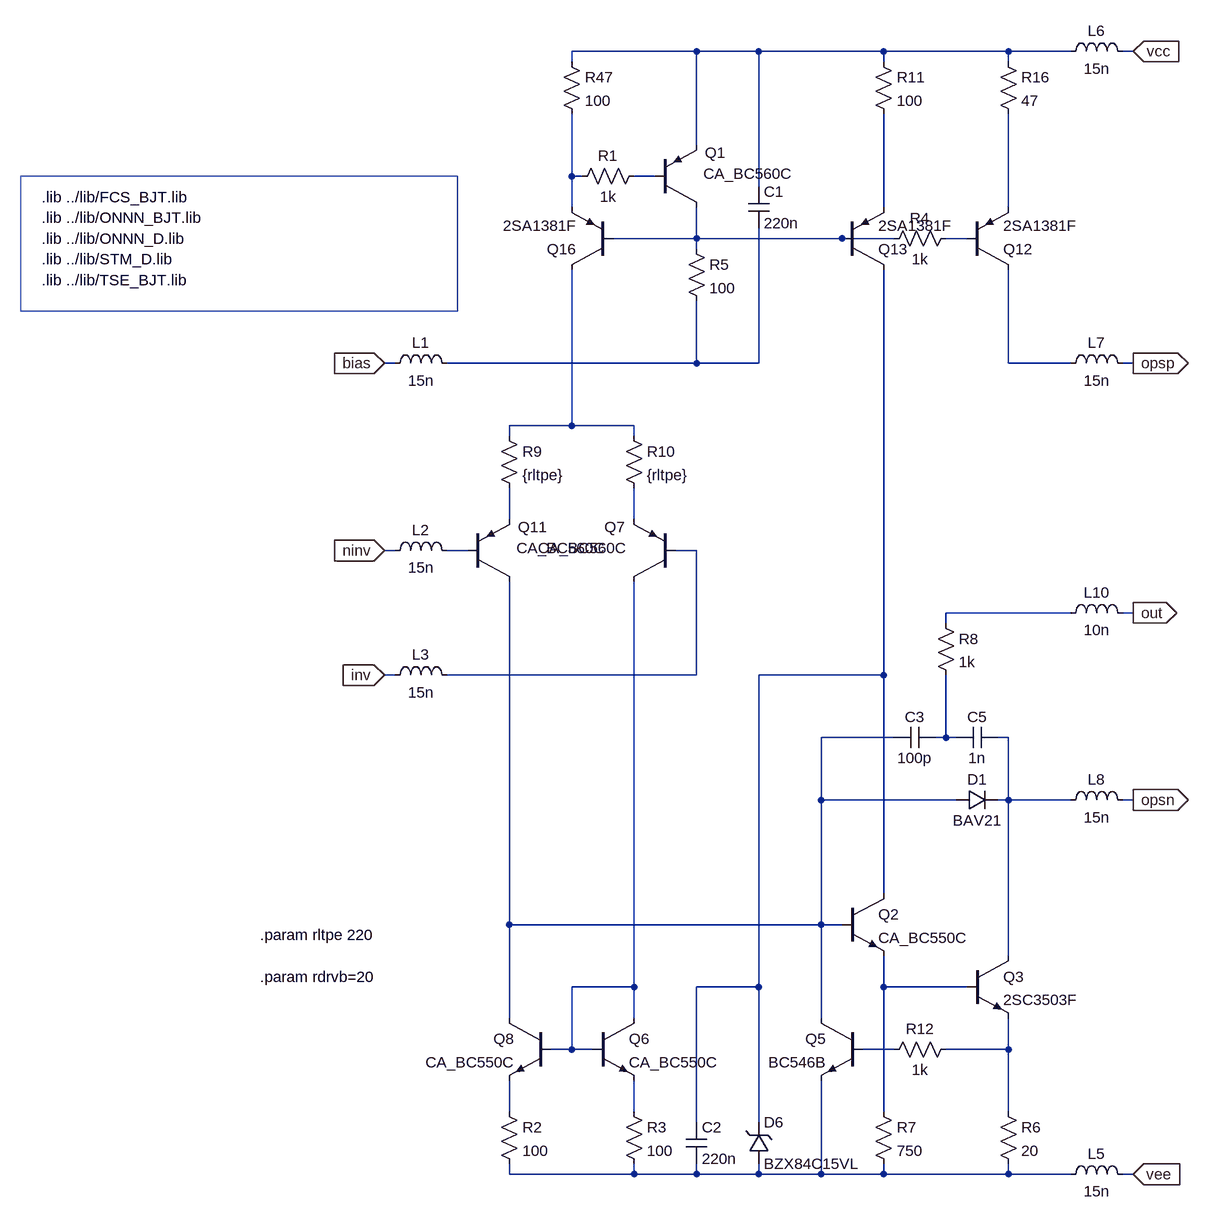
[diagram p0: schematic pab3bbb-mini-module.asc]
pab3bbb-mini-module.asc, the LTspice schematic file:
Version 4
SHEET 1 6124 2336
WIRE 288 -1088 96 -1088
WIRE 384 -1088 288 -1088
WIRE 576 -1088 384 -1088
WIRE 768 -1088 576 -1088
WIRE 864 -1088 768 -1088
WIRE 960 -1088 944 -1088
WIRE 96 -1072 96 -1088
WIRE 576 -1072 576 -1088
WIRE 768 -1072 768 -1088
WIRE 288 -944 288 -1088
WIRE 96 -896 96 -992
WIRE 112 -896 96 -896
WIRE 224 -896 192 -896
WIRE 384 -880 384 -1088
WIRE 96 -848 96 -896
WIRE 576 -848 576 -992
WIRE 768 -848 768 -992
WIRE 288 -800 288 -848
WIRE 288 -800 160 -800
WIRE 512 -800 288 -800
WIRE 592 -800 512 -800
WIRE 704 -800 672 -800
WIRE 288 -784 288 -800
WIRE -176 -608 -192 -608
WIRE 288 -608 288 -704
WIRE 288 -608 -96 -608
WIRE 384 -608 384 -816
WIRE 384 -608 288 -608
WIRE 768 -608 768 -752
WIRE 864 -608 768 -608
WIRE 960 -608 944 -608
WIRE 96 -512 96 -752
WIRE 96 -512 0 -512
WIRE 192 -512 96 -512
WIRE 0 -496 0 -512
WIRE 192 -496 192 -512
WIRE 0 -368 0 -416
WIRE 192 -368 192 -416
WIRE -176 -320 -192 -320
WIRE -64 -320 -96 -320
WIRE 288 -320 256 -320
WIRE 864 -224 672 -224
WIRE 960 -224 944 -224
WIRE 672 -208 672 -224
WIRE -176 -128 -192 -128
WIRE 288 -128 288 -320
WIRE 288 -128 -96 -128
WIRE 576 -128 576 -752
WIRE 576 -128 384 -128
WIRE 592 -32 480 -32
WIRE 672 -32 672 -128
WIRE 672 -32 656 -32
WIRE 688 -32 672 -32
WIRE 768 -32 752 -32
WIRE 480 64 480 -32
WIRE 688 64 480 64
WIRE 768 64 768 -32
WIRE 768 64 752 64
WIRE 864 64 768 64
WIRE 960 64 944 64
WIRE 576 208 576 -128
WIRE 0 256 0 -272
WIRE 480 256 480 64
WIRE 480 256 0 256
WIRE 512 256 480 256
WIRE 768 304 768 64
WIRE 192 352 192 -272
WIRE 192 352 96 352
WIRE 384 352 384 -128
WIRE 384 352 288 352
WIRE 576 352 576 304
WIRE 704 352 576 352
WIRE 0 400 0 256
WIRE 192 400 192 352
WIRE 480 400 480 256
WIRE 96 448 96 352
WIRE 96 448 64 448
WIRE 128 448 96 448
WIRE 592 448 544 448
WIRE 768 448 768 400
WIRE 768 448 672 448
WIRE 0 544 0 496
WIRE 192 544 192 496
WIRE 576 544 576 352
WIRE 768 544 768 448
WIRE 288 560 288 352
WIRE 384 560 384 352
WIRE 0 640 0 624
WIRE 192 640 192 624
WIRE 192 640 0 640
WIRE 288 640 288 624
WIRE 288 640 192 640
WIRE 384 640 384 624
WIRE 384 640 288 640
WIRE 480 640 480 496
WIRE 480 640 384 640
WIRE 576 640 576 624
WIRE 576 640 480 640
WIRE 768 640 768 624
WIRE 768 640 576 640
WIRE 864 640 768 640
WIRE 960 640 944 640
FLAG 960 -224 out
IOPIN 960 -224 Out
FLAG 960 -1088 vcc
IOPIN 960 -1088 In
FLAG 960 640 vee
IOPIN 960 640 In
FLAG -192 -320 ninv
IOPIN -192 -320 In
FLAG -192 -128 inv
IOPIN -192 -128 In
FLAG 960 -608 opsp
IOPIN 960 -608 Out
FLAG 960 64 opsn
IOPIN 960 64 Out
FLAG -192 -608 bias
IOPIN -192 -608 In
SYMBOL pnp -64 -272 M180
WINDOW 0 77 84 Left 2
WINDOW 3 75 52 Left 2
SYMATTR InstName Q11
SYMATTR Value CA_BC560C
SYMBOL res -16 528 R0
SYMATTR InstName R2
SYMATTR Value 100
SYMBOL res 176 528 R0
SYMATTR InstName R3
SYMATTR Value 100
SYMBOL res -16 -512 R0
SYMATTR InstName R9
SYMATTR Value {rltpe}
SYMBOL res 176 -512 R0
SYMATTR InstName R10
SYMATTR Value {rltpe}
SYMBOL res 752 -1088 R0
SYMATTR InstName R16
SYMATTR Value 47
SYMBOL res 80 -1088 R0
SYMATTR InstName R47
SYMATTR Value 100
SYMBOL npn 704 304 R0
SYMATTR InstName Q3
SYMATTR Value 2SC3503F
SYMBOL res 752 528 R0
SYMATTR InstName R6
SYMATTR Value 20
SYMBOL pnp 256 -272 R180
WINDOW 0 77 84 Left 2
WINDOW 3 75 52 Left 2
SYMATTR InstName Q7
SYMATTR Value CA_BC560C
SYMBOL cap 656 -48 R90
WINDOW 0 0 32 VBottom 2
WINDOW 3 32 32 VTop 2
SYMATTR InstName C3
SYMATTR Value 100p
SYMATTR SpiceLine V=100 Irms=20.8m Rser=5.448 Lser=3n Rpar=6.4meg Cpar=1p
SYMBOL npn 128 400 R0
SYMATTR InstName Q6
SYMATTR Value CA_BC550C
SYMBOL npn 64 400 M0
SYMATTR InstName Q8
SYMATTR Value CA_BC550C
SYMBOL npn 512 208 R0
SYMATTR InstName Q2
SYMATTR Value CA_BC550C
SYMBOL res 560 528 R0
SYMATTR InstName R7
SYMATTR Value 750
SYMBOL cap 752 -48 R90
WINDOW 0 0 32 VBottom 2
WINDOW 3 32 32 VTop 2
SYMATTR InstName C5
SYMATTR Value 1n
SYMATTR SpiceLine V=100 Irms=75.3m Rser=2.89088 Lser=3n Rpar=4.4meg Cpar=1p
SYMBOL res 656 -224 R0
SYMATTR InstName R8
SYMATTR Value 1k
SYMBOL diode 688 80 R270
WINDOW 0 32 32 VTop 2
WINDOW 3 0 32 VBottom 2
SYMATTR InstName D1
SYMATTR Value BAV21
SYMBOL ind 848 656 R270
WINDOW 0 32 56 VTop 2
WINDOW 3 5 56 VBottom 2
SYMATTR InstName L5
SYMATTR Value 15n
SYMATTR SpiceLine Rser=20m
SYMBOL ind 848 -1072 R270
WINDOW 0 32 56 VTop 2
WINDOW 3 5 56 VBottom 2
SYMATTR InstName L6
SYMATTR Value 15n
SYMATTR SpiceLine Rser=20m
SYMBOL ind 848 -592 R270
WINDOW 0 32 56 VTop 2
WINDOW 3 5 56 VBottom 2
SYMATTR InstName L7
SYMATTR Value 15n
SYMATTR SpiceLine Rser=20m
SYMBOL ind 848 80 R270
WINDOW 0 32 56 VTop 2
WINDOW 3 5 56 VBottom 2
SYMATTR InstName L8
SYMATTR Value 15n
SYMATTR SpiceLine Rser=20m
SYMBOL ind -192 -304 R270
WINDOW 0 32 56 VTop 2
WINDOW 3 5 56 VBottom 2
SYMATTR InstName L2
SYMATTR Value 15n
SYMATTR SpiceLine Rser=20m
SYMBOL ind -192 -112 R270
WINDOW 0 32 56 VTop 2
WINDOW 3 5 56 VBottom 2
SYMATTR InstName L3
SYMATTR Value 15n
SYMATTR SpiceLine Rser=20m
SYMBOL ind 848 -208 R270
WINDOW 0 32 56 VTop 2
WINDOW 3 5 56 VBottom 2
SYMATTR InstName L10
SYMATTR Value 10n
SYMATTR SpiceLine Rser=10m
SYMBOL npn 544 400 M0
SYMATTR InstName Q5
SYMATTR Value BC546B
SYMBOL res 688 432 R90
WINDOW 0 0 56 VBottom 2
WINDOW 3 32 56 VTop 2
SYMATTR InstName R12
SYMATTR Value 1k
SYMBOL pnp 704 -752 M180
SYMATTR InstName Q12
SYMATTR Value 2SA1381F
SYMBOL pnp 160 -752 R180
SYMATTR InstName Q16
SYMATTR Value 2SA1381F
SYMBOL pnp 512 -752 M180
SYMATTR InstName Q13
SYMATTR Value 2SA1381F
SYMBOL res 560 -1088 R0
SYMATTR InstName R11
SYMATTR Value 100
SYMBOL zener 368 624 M180
WINDOW 0 24 64 Left 2
WINDOW 3 24 0 Left 2
SYMATTR InstName D6
SYMATTR Value BZX84C15VL
SYMATTR Description Diode
SYMATTR Type diode
SYMBOL cap 272 624 M180
WINDOW 0 24 56 Left 2
WINDOW 3 24 8 Left 2
SYMATTR InstName C2
SYMATTR Value 220n
SYMATTR SpiceLine V=25 Irms=1.76 Rser=0.057522 Lser=3n Rpar=4.4meg Cpar=1p
SYMBOL cap 368 -816 M180
WINDOW 0 24 56 Left 2
WINDOW 3 24 8 Left 2
SYMATTR InstName C1
SYMATTR Value 220n
SYMATTR SpiceLine V=25 Irms=1.76 Rser=0.057522 Lser=3n Rpar=4.4meg Cpar=1p
SYMBOL res 208 -912 R90
WINDOW 0 0 56 VBottom 2
WINDOW 3 32 56 VTop 2
SYMATTR InstName R1
SYMATTR Value 1k
SYMBOL pnp 224 -848 M180
WINDOW 0 77 84 Left 2
WINDOW 3 75 52 Left 2
SYMATTR InstName Q1
SYMATTR Value CA_BC560C
SYMBOL res 688 -816 R90
WINDOW 0 0 56 VBottom 2
WINDOW 3 32 56 VTop 2
SYMATTR InstName R4
SYMATTR Value 1k
SYMBOL ind -192 -592 R270
WINDOW 0 32 56 VTop 2
WINDOW 3 5 56 VBottom 2
SYMATTR InstName L1
SYMATTR Value 15n
SYMATTR SpiceLine Rser=20m
SYMBOL res 272 -800 R0
SYMATTR InstName R5
SYMATTR Value 100
TEXT -384 272 Left 2 !.param rltpe 220
TEXT -720 -832 Left 2 !.lib ../lib/ONNN_BJT.lib
TEXT -720 -768 Left 2 !.lib ../lib/STM_D.lib
TEXT -720 -864 Left 2 !.lib ../lib/FCS_BJT.lib
TEXT -720 -800 Left 2 !.lib ../lib/ONNN_D.lib
TEXT -720 -736 Left 2 !.lib ../lib/TSE_BJT.lib
TEXT -384 336 Left 2 !.param rdrvb=20
RECTANGLE Normal -80 -688 -752 -896

The netlist it stands for:
* pab3bbb-mini-module.asc
Q11 N017 N013 N011 0 CA_BC560C
R2 N024 N026 100
R3 N025 N026 100
R9 N010 N011 {rltpe}
R10 N010 N012 {rltpe}
R16 N001 N005 47
R47 N001 N002 100
Q3 N019 N021 N023 0 2SC3503F
R6 N023 N026 20
Q7 N020 N014 N012 0 CA_BC560C
C3 N018 N017 100p V=100 Irms=20.8m Rser=5.448 Lser=3n Rpar=6.4meg Cpar=1p
Q6 N020 N020 N025 0 CA_BC550C
Q8 N017 N020 N024 0 CA_BC550C
Q2 N016 N017 N021 0 CA_BC550C
R7 N021 N026 750
C5 N019 N018 1n V=100 Irms=75.3m Rser=2.89088 Lser=3n Rpar=4.4meg Cpar=1p
R8 N015 N018 1k
D1 N017 N019 BAV21
L5 N026 vee 15n Rser=20m
L6 N001 vcc 15n Rser=20m
L7 N009 opsp 15n Rser=20m
L8 N019 opsn 15n Rser=20m
L2 ninv N013 15n Rser=20m
L3 inv N014 15n Rser=20m
L10 N015 out 10n Rser=10m
Q5 N017 N022 N026 0 BC546B
R12 N023 N022 1k
Q12 N009 N007 N005 0 2SA1381F
Q16 N010 N006 N002 0 2SA1381F
Q13 N016 N006 N004 0 2SA1381F
R11 N001 N004 100
D6 N026 N016 BZX84C15VL
C2 N026 N016 220n V=25 Irms=1.76 Rser=0.057522 Lser=3n Rpar=4.4meg Cpar=1p
C1 N008 N001 220n V=25 Irms=1.76 Rser=0.057522 Lser=3n Rpar=4.4meg Cpar=1p
R1 N003 N002 1k
Q1 N006 N003 N001 0 CA_BC560C
R4 N007 N006 1k
L1 bias N008 15n Rser=20m
R5 N006 N008 100
.model D D
.lib standard.dio
.model NPN NPN
.model PNP PNP
.lib standard.bjt
.param rltpe 220
.lib ../lib/ONNN_BJT.lib
.lib ../lib/STM_D.lib
.lib ../lib/FCS_BJT.lib
.lib ../lib/ONNN_D.lib
.lib ../lib/TSE_BJT.lib
.param rdrvb=20
.backanno
.end